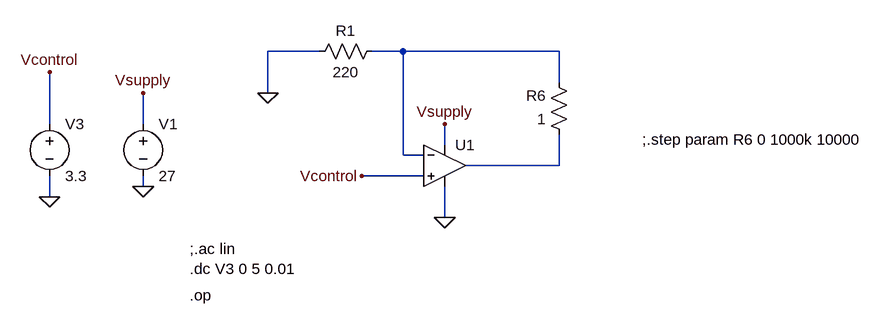
[diagram p0: schematic 2024-11-18-transconductance-amplifier.asc]
2024-11-18-transconductance-amplifier.asc, the LTspice schematic file:
Version 4
SHEET 1 1504 1044
WIRE 624 160 544 160
WIRE 752 160 704 160
WIRE 992 160 752 160
WIRE 992 208 992 160
WIRE 544 224 544 160
WIRE 208 272 208 192
WIRE 352 272 352 224
WIRE 816 304 816 272
WIRE 752 320 752 160
WIRE 784 320 752 320
WIRE 992 336 992 288
WIRE 992 336 848 336
WIRE 784 352 688 352
WIRE 352 368 352 352
WIRE 208 384 208 352
WIRE 816 416 816 368
FLAG 816 416 0
FLAG 352 368 0
FLAG 352 224 Vsupply
FLAG 816 272 Vsupply
FLAG 688 352 Vcontrol
FLAG 208 192 Vcontrol
FLAG 208 384 0
FLAG 544 224 0
DATAFLAG 864 160 ""
SYMBOL Opamps\\UniversalOpamp2 816 336 R0
SYMATTR InstName U1
SYMBOL voltage 352 256 R0
WINDOW 123 0 0 Left 0
WINDOW 39 0 0 Left 0
SYMATTR InstName V1
SYMATTR Value 27
SYMBOL res 720 144 R90
WINDOW 0 0 56 VBottom 2
WINDOW 3 32 56 VTop 2
SYMATTR InstName R1
SYMATTR Value 220
SYMBOL voltage 208 256 R0
WINDOW 123 0 0 Left 0
WINDOW 39 0 0 Left 0
SYMATTR InstName V3
SYMATTR Value 3.3
SYMBOL res 1008 304 R180
WINDOW 0 36 76 Left 2
WINDOW 3 36 40 Left 2
SYMATTR InstName R6
SYMATTR Value 1
TEXT 424 464 Left 2 !;.ac lin\n.dc V3 0 5 0.01
TEXT 1120 296 Left 2 !;.step param R6 0 1000k 10000
TEXT 424 536 Left 2 !.op

The netlist it stands for:
* 2024-11-18-transconductance-amplifier.asc
XU1 Vcontrol N001 Vsupply 0 N002 level.2 Avol=1Meg GBW=10Meg Slew=10Meg ilimit=25m rail=0 Vos=0 phimargin=45 en=0 enk=0 in=0 ink=0 Rin=500Meg  ; pins IN+ IN- V+ V- OUT
V1 Vsupply 0 27
R1 N001 0 220
V3 Vcontrol 0 3.3
R6 N002 N001 1
;.ac lin
.dc V3 0 5 0.01
;.step param R6 0 1000k 10000
.op
.lib UniversalOpamps2.sub
.backanno
.end